# Altium schematic sheet Analog_Power.SchDoc
size 381 x 279 mm; Date: 9/28/2025; Organization: SACO Technologies; Address1: 7806, Trans-Canada Hwy; Address2: Montreal, QC, Canada - H4S1L3.; Address3: H4S1L3; ProjectRevision: C; SheetNumber: 4; SheetTotal: 7; SchDesignedBy1: Alexis Gagnon; SchDesignedBy2: Megane Cyr; ELE682ProjectName: Conditioning & TLL PCB
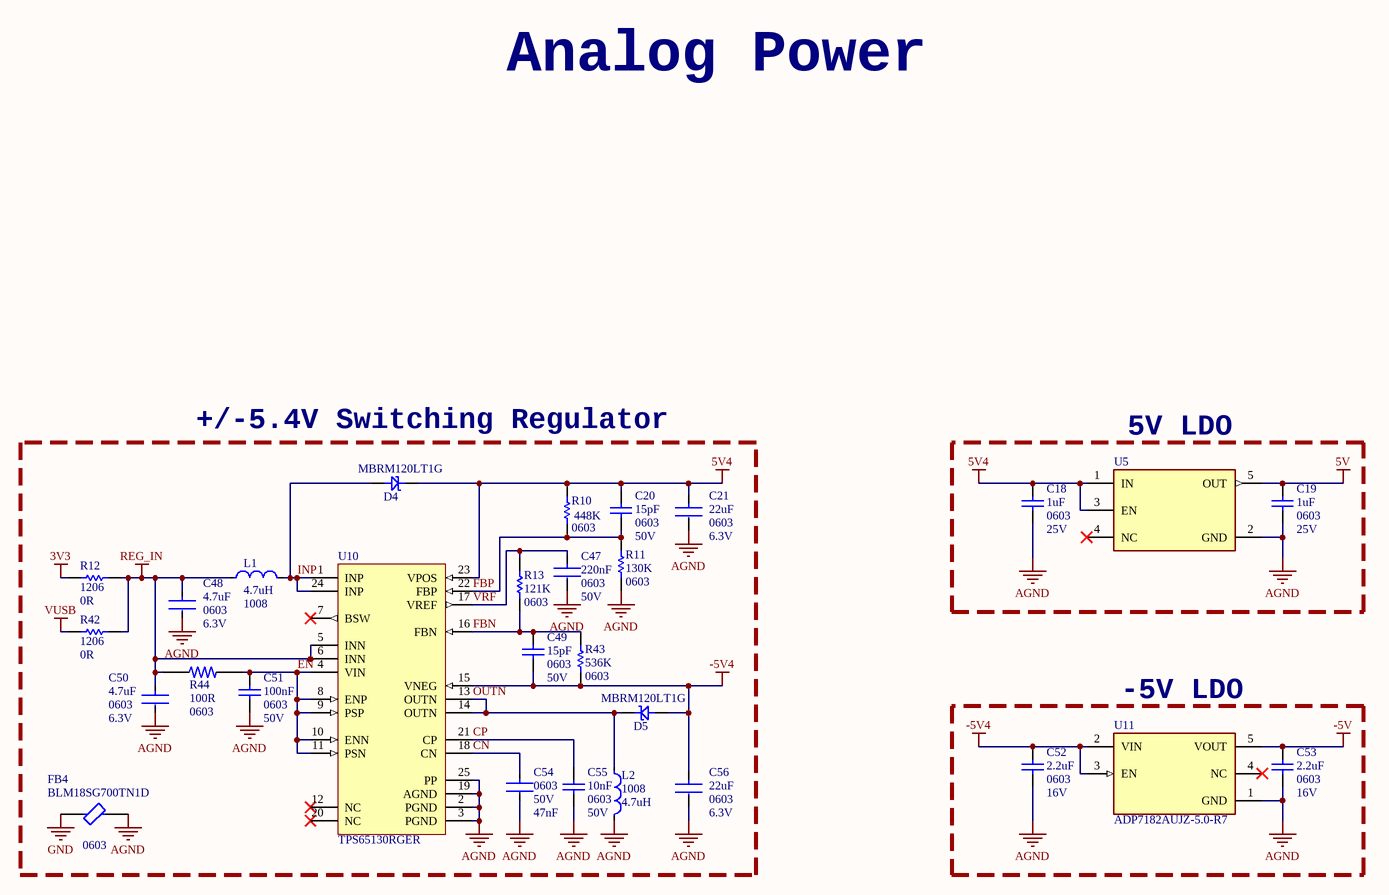
[diagram p0: Analog_Power.SchDoc]

## Parts
C18  value 1uF  Case/Package: 0603  Rated DC Voltage (URdc): 25V  [C0603-V2]  (hidden comment: CL10A105KA8NNNC)
C19  value 1uF  Case/Package: 0603  Rated DC Voltage (URdc): 25V  [C0603-V2]  (hidden comment: CL10A105KA8NNNC)
C20  value 15pF  Packaging: 0603  Voltage: 50V  [C0603-V2]  (hidden comment: CL10C150JB8NNNC)
C21  value 22uF  Rated DC Voltage (URdc): 6.3V  Case/Package: 0603  [C0603-V2]  (hidden comment: GRM188R60J226MEA0D)
C47  value 220nF  Voltage Rating: 50V  Case Code (Imperial): 0603  [C0603-V2]  (hidden comment: GRM188R71H224KAC4D)
C48  Package: 0603  Capacitance: 4.7uF  Voltage Rating: 6.3V  [FP-C0603-CG-IPC_B]  (hidden comment: C0603C475K9PACTU)
C49  value 15pF  Packaging: 0603  Voltage: 50V  [C0603-V2]  (hidden comment: CL10C150JB8NNNC)
C50  Package: 0603  Capacitance: 4.7uF  Voltage Rating: 6.3V  [FP-C0603-CG-IPC_B]  (hidden comment: C0603C475K9PACTU)
C51  value 100nF  Case/Package: 0603  Voltage Rating: 50V  [C0603-V2]  (hidden comment: CL10B104KB8NNWC)
C52  value 2.2uF  Case/Package: 0603  Rated DC Voltage (URdc): 16V  [C0603-V2]  (hidden comment: CL10A225KO8NNNC)
C53  value 2.2uF  Case/Package: 0603  Rated DC Voltage (URdc): 16V  [C0603-V2]  (hidden comment: CL10A225KO8NNNC)
C54  Case Code (Imperial): 0603  Voltage Rating: 50V  Capacitance: 47nF  [C0603]  (hidden comment: GCJ188R71H473KA12D)
C55  Voltage Rating: 50V  Case/Package: 0603  Capacitance: 10nF  [C0603-V2]  (hidden comment: GRM188R71H103KA01D)
C56  value 22uF  Rated DC Voltage (URdc): 6.3V  Case/Package: 0603  [C0603-V2]  (hidden comment: GRM188R60J226MEA0D)
D4  MBRM120LT1G  [ONSC-POWERMITE-2-457-04_D_V]
D5  MBRM120LT1G  [ONSC-POWERMITE-2-457-04_D_V]
FB4  BLM18SG700TN1D  Case Code (Imperial): 0603  [BLM18SG700TN1D-MFG]
L1  Case/Package: 1008  Inductance: 4.7uH  [FP-DFE252012C-MFG]  (hidden comment: 1239AS-H-4R7M=P2)
L2  Case/Package: 1008  Inductance: 4.7uH  [FP-DFE252012C-MFG]  (hidden comment: 1239AS-H-4R7M=P2)
R10  value 448K  Case/Package: 0603  [R0603]  (hidden comment: RT0603BRD07448KL)
R11  value 130K  Case/Package: 0603  [R0603]  (hidden comment: AC0603FR-07130KL)
R12  Case/Package: 1206  Resistance: 0R  [R1206]  (hidden comment: RC1206JR-070RL)
R13  value 121K  Case/Package: 0603  [R0603]  (hidden comment: RC0603FR-07121KL)
R42  Case/Package: 1206  Resistance: 0R  [R1206]  (hidden comment: RC1206JR-070RL)
R43  value 536K  Case/Package: 0603  [R0603]  (hidden comment: RC0603FR-07536KL)
R44  value 100R  Case/Package: 0603  [R0603]  (hidden comment: RC0603FR-07100RL)
U5  NCP161ASN500T1G  [FP-527AH-MFG]  (value not drawn)
U10  TPS65130RGER  [TI-RGE24-2450X2450TP_V]
U11  ADP7182AUJZ-5.0-R7  [FP-UJ-5-IPC_B]

## Blocks framed on the sheet
+/-5.4V Switching Regulator: C20 C21 C47-C51 C54-C56 D4 D5 FB4 L1 L2 R10-R13 R42-R44 U10
5V LDO: C18 C19 U5
-5V LDO: C52 C53 U11

## Nets
3V3: R12.1
5V: C19.2 U5.5(OUT)
5V4: C18.2 C20.2 C21.1 D4.1(K) R10.1 U5.1(IN) U5.3(EN) U10.23(VPOS)
-5V: C53.2 U11.5(VOUT)
-5V4: C49.1 C52.2 C56.1 D5.2(A) R43.2 U10.15(VNEG) U11.2(VIN) U11.3(EN)
AGND: C18.1 C19.1 C21.2 C47.2 C48.2 C50.2 C51.2 C52.1 C53.1 C54.1 C55.1 C56.2 FB4.2 L2.2 R11.2 U5.2(GND) U10.2(PGND) U10.3(PGND) U10.19(AGND) U10.25(PP) U11.1(GND)
GND: FB4.1
REG_IN: C48.1 C50.1 L1.1 R12.2 R42.2 R44.1 U10.5(INN) U10.6(INN)
VUSB: R42.1
CN: C54.2 U10.18(CN)
CP: C55.2 U10.21(CP)
EN: C51.1 R44.2 U10.4(VIN) U10.8(ENP) U10.9(PSP) U10.10(ENN) U10.11(PSN)
FBN: C49.2 R13.2 R43.1 U10.16(FBN)
FBP: C20.1 R10.2 R11.1 U10.22(FBP)
INP: D4.2(A) L1.2 U10.1(INP) U10.24(INP)
OUTN: D5.1(K) L2.1 U10.13(OUTN) U10.14(OUTN)
VRF: C47.1 R13.1 U10.17(VREF)

Not connected (* = marked no-connect by the designer): U5 4(NC)*; U10 7(BSW)* 12(NC)* 20(NC)*; U11 4(NC)*

## Notes on the sheet
- Analog Power
- Project:
- File:
- Date:
- Designed By :
- © COPYRIGHT 2024 École de Technologie Supérieure
- Revision:
- Sheet
- of
- 1100 Rue Notre-Dame Ouest, Montréal, QC H3C 1K3

## Library data of the parts
C18 C19 = CL10A105KA8NNNC: CAP CER 1UF 25V X5R 0603; Manufacturer: Samsung; Dielectric Material: Ceramic; Multilayer: Yes; Tolerance  (fill in as +-): 10%; Supplier: Arrow Electronics; Supplier Part Number: CL10A105KA8NNNC; Manufacturer Part Number: CL10A105KA8NNNC; RoHS: Yes; Category: Ceramic Capacitors; Stock: 444000; Pricing: 4000=0.0054, 8000=0.0044, 28000=0.0037, 100000=0.0034, 200000=0.0032 (USD); Mounting Technology: Surface Mount; Pins: 2; Package Shape: Rectangular; Terminal Finish: Nickel; Min Operating Temperature: -55°C; Max Operating Temperature: 85°C; JESD-609 Code: e3; Capacitor Type: Ceramic; Package Style: SMTMeter; Packaging: Tape and Reel; Tolerance (fill in as +-): 10%; Temperature Characteristics Code: X5R; Termination: Wraparound; Length: 1.6mm; Width: 0.8mm; Height: 0.9mm; Reach SVHC Compliant: Yes; RoHS Compliant: Yes; ComponentLink1URL: https://datasheet.ciiva.com:443/pdfs/VipMasterIC/IC/SEMS/SEMS-S-A0008520814/SEMS-S-A0008520762-1.pdf?src-supplier=IHS+Markit; ComponentLink1Description: https://datasheet.ciiva.com:443/pdfs/VipMasterIC/IC/SEMS/SEMS-S-A0008520814/SEMS-S-A0008520762-1.pdf?src-supplier=IHS+Markit; ComponentLink2URL: https://datasheet.ciiva.com/25801/cl10a105ka8nnnc-25801364.pdf?src-supplier=Digikey; ComponentLink2Description: https://datasheet.ciiva.com/25801/cl10a105ka8nnnc-25801364.pdf?src-supplier=Digikey; ComponentLink3URL: https://datasheet.ciiva.com/26838/getdatasheetpartid-357530-26838332.pdf?src-supplier=Verical; ComponentLink3Description: https://datasheet.ciiva.com/26838/getdatasheetpartid-357530-26838332.pdf?src-supplier=Verical; ComponentLink4URL: https://datasheet.ciiva.com/29198/458162-da-01-en-vs-kondensator-0603-29198475.pdf?src-supplier=Conrad; ComponentLink4Description: https://datasheet.ciiva.com/29198/458162-da-01-en-vs-kondensator-0603-29198475.pdf?src-supplier=Conrad
C20 C49 = CL10C150JB8NNNC: CAP CER 15PF 50V C0G/NP0 0603; Supplier 1: DigiKey; Supplier Part Number 1: 1276-1296-1-ND
C21 C56 = GRM188R60J226MEA0D: CAP CER 22UF 6.3V X5R 0603; Manufacturer: Murata; Dielectric Material: Ceramic; Multilayer: Yes; Tolerance  (fill in as +-): 20%; Supplier: Mouser; Supplier Part Number: 81-GRM188R60J226ME0D; Manufacturer Part Number: GRM188R60J226MEA0D; RoHS: Yes; Category: Ceramic Capacitors; Stock: 837789; Pricing: 1=0.1, 10=0.026, 50=0.026, 100=0.024, 1000=0.024, 10000=0.024 (USD); Mounting Technology: Surface Mount; Pins: 2; Package Shape: Rectangular; Terminal Finish: Nickel; Min Operating Temperature: -55°C; Max Operating Temperature: 85°C; JESD-609 Code: e3; Package Style: SMTMeter; Capacitor Type: Ceramic; Packaging: Tape and Reel; Tolerance (fill in as +-): 20%; Temperature Characteristics Code: X5R; Termination: Wraparound; Length: 1.6mm; Width: 0.8mm; Height: 0.8mm; Reach SVHC Compliant: Yes; RoHS Compliant: Yes; ComponentLink1URL: https://datasheet.ciiva.com:443/pdfs/VipMasterIC/IC/MURE/MURE-S-A0004349797/MURE-S-A0004352371-1.pdf?src-supplier=IHS+Markit; ComponentLink1Description: https://datasheet.ciiva.com:443/pdfs/VipMasterIC/IC/MURE/MURE-S-A0004349797/MURE-S-A0004352371-1.pdf?src-supplier=IHS+Markit; ComponentLink2URL: https://datasheet.ciiva.com/29540/partnumbering-e-01-29540441.pdf?src-supplier=Digikey; ComponentLink2Description: https://datasheet.ciiva.com/29540/partnumbering-e-01-29540441.pdf?src-supplier=Digikey; ComponentLink3URL: https://datasheet.ciiva.com/29540/partnumbering-e-01-29540442.pdf?src-supplier=Digikey; ComponentLink3Description: https://datasheet.ciiva.com/29540/partnumbering-e-01-29540442.pdf?src-supplier=Digikey; ComponentLink4URL: https://datasheet.ciiva.com/29540/partnumbering-e-01-29540443.pdf?src-supplier=Digikey; ComponentLink4Description: https://datasheet.ciiva.com/29540/partnumbering-e-01-29540443.pdf?src-supplier=Digikey
C47 = GRM188R71H224KAC4D: CAP CER 0.22UF 50V X7R 0603; Manufacturer: Murata; Manufacturer Lifecycle Status: IN PRODUCTION; Dielectric Material: Ceramic; Tolerance: 10%; Supplier: Avnet; Supplier Part Number: GRM188R71H224KAC4D; Manufacturer Part Number: GRM188R71H224KAC4D; RoHS: Compliant; Category: Ceramic Capacitors; Stock: 36000; Pricing: 4000=0.01597, 8000=0.0158, 16000=0.01571, 24000=0.01563, 32000=0.01555 (USD); Case/Package: 0603; Case Code (Metric): 1608; Dielectric: X7R; Height: 800µm; Lead Free: Lead Free; Length: 1.6mm; Lifecycle Status: Production; Material: Ceramic; Max Operating Temperature: 125°C; Min Operating Temperature: -55°C; Mounting Technology: Surface Mount; Number of Terminals: 2; REACH SVHC: Yes; Schedule B: 8532240020, 8532240020|8532240020, 8532240020|8532240020|8532240020, 8532240020|8532240020|8532240020|8532240020; Thickness: 800µm; Voltage Rating (DC): 50V; Width: 800µm; ComponentLink1URL: https://datasheet.octopart.com:443/GRM188R71H224KAC4D-Murata-datasheet-149523289.pdf?src-supplier=Newark; ComponentLink1Description: https://datasheet.octopart.com:443/GRM188R71H224KAC4D-Murata-datasheet-149523289.pdf?src-supplier=Newark; ComponentLink2URL: https://datasheet.octopart.com:443/GRM188R71H224KAC4D-Murata-datasheet-68590313.pdf?src-supplier=Newark; ComponentLink2Description: https://datasheet.octopart.com:443/GRM188R71H224KAC4D-Murata-datasheet-68590313.pdf?src-supplier=Newark; ComponentLink3URL: https://datasheet.octopart.com:443/GRM188R71H224KAC4D-Murata-datasheet-141275521.pdf?src-supplier=Geoflip; ComponentLink3Description: https://datasheet.octopart.com:443/GRM188R71H224KAC4D-Murata-datasheet-141275521.pdf?src-supplier=Geoflip; ComponentLink4URL: https://datasheet.octopart.com/GRM188R71H224KAC4D-Murata-datasheet-13366452.pdf; ComponentLink4Description: https://datasheet.octopart.com/GRM188R71H224KAC4D-Murata-datasheet-13366452.pdf; ComponentLink5URL: https://datasheet.octopart.com/GRM188R71H224KAC4D-Murata-datasheet-12515295.pdf; ComponentLink5Description: https://datasheet.octopart.com/GRM188R71H224KAC4D-Murata-datasheet-12515295.pdf; ComponentLink6URL: https://datasheet.octopart.com/GRM188R71H224KAC4D-Murata-datasheet-12510076.pdf; ComponentLink6Description: https://datasheet.octopart.com/GRM188R71H224KAC4D-Murata-datasheet-12510076.pdf; ComponentLink7URL: https://datasheet.octopart.com/GRM188R71H224KAC4D-Murata-datasheet-11978611.pdf; ComponentLink7Description: https://datasheet.octopart.com/GRM188R71H224KAC4D-Murata-datasheet-11978611.pdf; ComponentLink8URL: https://datasheet.octopart.com/GRM188R71H224KAC4D-Murata-datasheet-10025737.pdf; ComponentLink8Description: https://datasheet.octopart.com/GRM188R71H224KAC4D-Murata-datasheet-10025737.pdf; ComponentLink9URL: https://datasheet.octopart.com/GRM188R71H224KAC4D-Murata-datasheet-8819587.pdf; ComponentLink9Description: https://datasheet.octopart.com/GRM188R71H224KAC4D-Murata-datasheet-8819587.pdf; ComponentLink10URL: https://datasheet.octopart.com:443/GRM188R71H224KAC4D-Murata-datasheet-165579666.pdf?src-supplier=TME; ComponentLink10Description: https://datasheet.octopart.com:443/GRM188R71H224KAC4D-Murata-datasheet-165579666.pdf?src-supplier=TME; ComponentLink11URL: https://datasheet.octopart.com:443/GRM188R71H224KAC4D-Murata-datasheet-140705679.pdf?src-supplier=Ciiva; ComponentLink11Description: https://datasheet.octopart.com:443/GRM188R71H224KAC4D-Murata-datasheet-140705679.pdf?src-supplier=Ciiva; ComponentLink12URL: https://datasheet.octopart.com:443/GRM188R71H224KAC4D-Murata-datasheet-138743219.pdf?src-supplier=Ciiva; ComponentLink12Description: https://datasheet.octopart.com:443/GRM188R71H224KAC4D-Murata-datasheet-138743219.pdf?src-supplier=Ciiva; ComponentLink13URL: https://datasheet.octopart.com:443/GRM188R71H224KAC4D-Murata-datasheet-14397325.pdf?src-supplier=Future+Electronics; ComponentLink13Description: https://datasheet.octopart.com:443/GRM188R71H224KAC4D-Murata-datasheet-14397325.pdf?src-supplier=Future+Electronics; ComponentLink14URL: https://datasheet.octopart.com:443/GRM188R71H224KAC4D-Murata-datasheet-150009171.pdf?src-supplier=Arrow.cn; ComponentLink14Description: https://datasheet.octopart.com:443/GRM188R71H224KAC4D-Murata-datasheet-150009171.pdf?src-supplier=Arrow.cn; ComponentLink15URL: http://sigma.octopart.com:80/reach_statement/Murata-company-16.pdf?src-supplier=Compliance+Statements; ComponentLink15Description: http://sigma.octopart.com:80/reach_statement/Murata-company-16.pdf?src-supplier=Compliance+Statements
C48 C50 = CMP-2006-02256-2: CAP CER 4.7UF 6.3V X5R 0603; Manufacturer: Kemet; Temperature Coefficient: 15%; Tolerance: 10%; Material: Ceramic; Device Class L3: Ceramic Capacitors; RoHS: TRUE; Value: 4.7uF; Lead Free: Yes; ComponentLink2Description: Datasheet; Mouser Description: Multilayer Ceramic Capacitors MLCC - SMD/SMT 6.3volts 4.7uF X5R 10%; Digikey Description: CAP CER 4.7UF 6.3V X5R 0603; ComponentLink2URL: https://content.kemet.com/datasheets/KEM_C1006_X5R_SMD.pdf; Category: Cap; Temperature Range Low: -55°C; Temperature: -55°C to +85°C; Octopart: https://octopart.com/c0603c475k9pactu-kemet-104242; Ipc Land Pattern Name: CAPC16080X80; Temperature Range High: +85°C; Height: 0.9mm; Temperature Characteristic: X5R; Device Class L1: Passive Components; Manufacturer Part Number: C0603C475K9PACTU; Automotive: No; Device Class L2: Capacitors
C51 = CL10B104KB8NNWC: CAP CER 0.1UF 50V X7R 0603; Manufacturer: Samsung; Tolerance: 10%; Supplier: Arrow Electronics; Supplier Part Number: CL10B104KB8NNWC; Manufacturer Part Number: CL10B104KB8NNWC; RoHS: Yes; Category: Ceramic Capacitors; Stock: 4312000; Pricing: 4000=0.0024 (USD); Mounting Technology: Surface Mount; Case Code (Metric): 1608; Case Code (Imperial): 0603; Min Operating Temperature: -55°C; Max Operating Temperature: 125°C; Package Quantity: 1; Packaging: Cut Tape; Series: CL; Length: 0.063inch; Width: 0.031inch; Thickness: 0.035inch; RoHS Compliant: Yes; ComponentLink1URL: https://datasheet.ciiva.com/25740/cl10b104kb8nnwc-25740227.pdf?src-supplier=Digikey; ComponentLink1Description: https://datasheet.ciiva.com/25740/cl10b104kb8nnwc-25740227.pdf?src-supplier=Digikey
C52 C53 = CL10A225KO8NNNC: CAP CER 2.2UF 16V X5R 0603; Manufacturer: Samsung; Dielectric Material: Ceramic; Multilayer: Yes; Tolerance  (fill in as +-): 10%; Supplier: Arrow Electronics; Supplier Part Number: CL10A225KO8NNNC; Manufacturer Part Number: CL10A225KO8NNNC; RoHS: Yes; Category: Ceramic Capacitors; Stock: 1492000; Pricing: 4000=0.0119, 8000=0.0101, 12000=0.0092, 28000=0.0082, 100000=0.0069, 200000=0.0066 (USD); Mounting Technology: Surface Mount; Pins: 2; Package Shape: Rectangular; Terminal Finish: Nickel; Min Operating Temperature: -55°C; Max Operating Temperature: 85°C; JESD-609 Code: e3; Capacitor Type: Ceramic; Package Style: SMTMeter; Packaging: Tape and Reel; Tolerance (fill in as +-): 10%; Temperature Characteristics Code: X5R; Termination: Wraparound; Length: 1.6mm; Width: 0.8mm; Height: 0.9mm; Reach SVHC Compliant: Yes; RoHS Compliant: Yes; ComponentLink1URL: https://datasheet.ciiva.com:443/pdfs/VipMasterIC/IC/SEMS/SEMS-S-A0008524842/SEMS-S-A0008524788-1.pdf?src-supplier=IHS+Markit; ComponentLink1Description: https://datasheet.ciiva.com:443/pdfs/VipMasterIC/IC/SEMS/SEMS-S-A0008524842/SEMS-S-A0008524788-1.pdf?src-supplier=IHS+Markit; ComponentLink2URL: http://www.farnell.com/datasheets/2735906.pdf?src-supplier=Newark; ComponentLink2Description: http://www.farnell.com/datasheets/2735906.pdf?src-supplier=Newark
C54 = CMP-2006-02231-3: Cap Ceramic 47000pF 50V X7R 10% Pad SMD 0603 Soft Termination +125°C Automotive T/R; Ratings: AEC-Q200; Packaging: Tape and Reel; Termination: SMD/SMT; Features: Soft Termination; Min Operating Temperature: -55°C; Package Quantity: 1; Width: 0.031inch; Case Code (Metric): 1608; Max Operating Temperature: 125°C; Voltage Rating (DC): 50V; Tolerance: 10%; Thickness: 0.031inch; Length: 0.063inch; Dielectric: X7R; Mount: Surface Mount; Case/Package: 0603
C55 = CMP-2100-03642-1: Chip Capacitor, 10 nF, +/- 10%, 50 V, -55 to 125 degC, 0603 (1608 Metric), RoHS, Tape and Reel; Manufacturer: Murata; Insulation Resistance: 10GR; Dielectric: X7R; Material: Ceramic; Package Quantity: 1; Lead Free: LeadFree; Termination: SMD/SMT; REACH SVHC: Unknown; Manufacturer URL: http://www.murata.com/; Datasheet URL: http://search.murata.co.jp/Ceramy/image/img/A01X/G101/ENG/GRM188R71H103KA01-01.pdf; Mount: SurfaceMount; Datasheet Version: 42401.0; Number of Pins: 2; Length: 1.6mm; Voltage: 50V; Depth: 0.8mm; Tolerance: 10%; Min Operating Temperature: -55degC; Voltage Rating (DC): 50V; Max Operating Temperature: 125degC; Package Description: 2-Pin Surface Mount Device, Body 1.6 x 0.8 mm; RoHSCompliant: True; Case Code (Imperial): 0603; Width: 0.031inch; Case Code (Metric): 1608; Height: 0.8mm; Package Reference: 0603; Packaging: TapeandReel; Thickness: 0.035inch; Dielectric Material: Ceramic
D4 D5 = MBRM120LT1G: DIODE SCHOTTKY 20V 1A POWERMITE; Manufacturer: On Semiconductor; IFSM Max (A): 50; Configuration: Single; Packing: Tape and Reel; ComponentLink1Description: Manufacturer URL; ComponentLink3URL: http://www.onsemi.com/pub_link/Collateral/457-04.PDF; PackageDescription: 2-Pin POWERMITE, Body 1.965 x 1.9 mm; DatasheetVersion: Rev. 7; Mounting Technology: Surface Mount; ComponentLink1URL: http://www.onsemi.com/; PackageVersion: Rev. F, 05/2013; ComponentLink2Description: Datasheet; PackageReference: POWERMITE-2-457-04; RoHS: TRUE; PartNumber: MBRM120LT1G; ComponentLink2URL: http://www.onsemi.cn/pub_link/Collateral/MBRM120L-D.PDF; ComponentLink3Description: Package Specification
FB4 = BLM18SG700TN1D: FERRITE BEAD 70 OHM 0603 1LN; Manufacturer: Murata; Max DC Current: 4A; Tolerance: 25%; DC Resistance (DCR): 20mR; Material: Steel; Test Frequency: 100MHz; Number of Circuits: 1; Impedance: 70R; Filter Type: FERRITE CHIP; Lead Free: Lead Free; Min Operating Temperature: -55°C; Width: 0.8mm; Case Code (Metric): 1608; RoHS Compliant: Yes; Core Material: Ferrite; Max Operating Temperature: 125°C; Number of Pins: 2; Current Rating: 4A; Series: BLM18S; Depth: 0.8mm; Packaging: Tape and Reel; Height: 0.8mm; Number of Lines: 1; Case/Package: 0603; Package Quantity: 1; Termination: SMD/SMT; REACH SVHC: No SVHC; Max Current Rating: 4A; DC Resistance-Max: 20mR; Length: 1.6mm; Supplier: Mouser; Supplier Part Number: 81-BLM18SG700TN1D; Manufacturer Part Number: BLM18SG700TN1D; RoHS: Yes; Category: Ferrite Beads and Chips; Stock: 139676; Pricing: 1=0.14, 10=0.071, 50=0.071, 100=0.049, 1000=0.041, 10000=0.03 (USD); Mounting Technology: Surface Mount; Case Code: 0603; Terminal Finish: Tin; JESD-609 Code: e3; Construction: Chip Bead; Clock Frequency: 100MHz; Min Frequency: 100MHz; Channels: 1; Output Impedance: 70R; Reach SVHC Compliant: Yes; ComponentLink1URL: https://datasheet.ciiva.com:443/pdfs/VipMasterIC/IC/MURE/MURE-S-A0008515766/MURE-S-A0008515869-1.pdf?src-supplier=IHS+Markit; ComponentLink1Description: https://datasheet.ciiva.com:443/pdfs/VipMasterIC/IC/MURE/MURE-S-A0008515766/MURE-S-A0008515869-1.pdf?src-supplier=IHS+Markit; ComponentLink2URL: https://datasheet.ciiva.com/8021/5151-8021529.pdf?src-supplier=Element14; ComponentLink2Description: https://datasheet.ciiva.com/8021/5151-8021529.pdf?src-supplier=Element14; ComponentLink3URL: https://datasheet.ciiva.com/8021/5151-8021530.pdf?src-supplier=Element14; ComponentLink3Description: https://datasheet.ciiva.com/8021/5151-8021530.pdf?src-supplier=Element14; ComponentLink4URL: https://datasheet.ciiva.com/14122/blm-series-eng-tds-14122901.pdf?src-supplier=Distrelec; ComponentLink4Description: https://datasheet.ciiva.com/14122/blm-series-eng-tds-14122901.pdf?src-supplier=Distrelec; ComponentLink5URL: https://datasheet.ciiva.com/6212/l0110s0100blm18s-6212357.pdf?src-supplier=Digikey; ComponentLink5Description: https://datasheet.ciiva.com/6212/l0110s0100blm18s-6212357.pdf?src-supplier=Digikey; ComponentLink6URL: https://datasheet.ciiva.com/6212/l0110s0100blm18s-6212359.pdf?src-supplier=Digikey; ComponentLink6Description: https://datasheet.ciiva.com/6212/l0110s0100blm18s-6212359.pdf?src-supplier=Digikey; ComponentLink7URL: https://datasheet.ciiva.com/16420/l0110s0100blm18s-16420729.pdf?src-supplier=Future+Electronics; ComponentLink7Description: https://datasheet.ciiva.com/16420/l0110s0100blm18s-16420729.pdf?src-supplier=Future+Electronics
L1 L2 = 1239AS-H-4R7M=P2: Shielded Wirewound Inductor 4.7uH 20% 1300mA 0.24Ω 1008 (2520); Current Rating: 1.5A; Core Material: Ferrite; DC Resistance (DCR): 240mR; Test Frequency: 1MHz; Resistor Type: Wirewound; Mount: Surface Mount; Case Code (Metric): 2520; Width: 0.079inch; Min Operating Temperature: -40°C; Height - Seated (Max): 0.047inch; Length: 0.098inch; Max Operating Temperature: 85°C; Tolerance: 20%; Case Code (Imperial): 1008; Shielding: Shielded; Packaging: Tape and Reel
R10 = RT0603BRD07448KL: RES 448K OHM 0.1% 1/10W 0603; ComponentLink1URL: https://datasheet.ciiva.com:443/pdfs/VipMasterIC/IC/YAGO/YAGO-S-A0008145938/YAGO-S-A0008145938-1.pdf?src-supplier=IHS+Markit; ComponentLink1Description: https://datasheet.ciiva.com:443/pdfs/VipMasterIC/IC/YAGO/YAGO-S-A0008145938/YAGO-S-A0008145938-1.pdf?src-supplier=IHS+Markit; Supplier 1: DigiKey; Supplier Part Number 1: 13-RT0603BRD07448KLCT-ND
R11 = AC0603FR-07130KL: RES SMD 130K OHM 1% 1/10W 0603; ComponentLink1URL: https://datasheet.ciiva.com:443/pdfs/VipMasterIC/IC/YAGO/YAGO-S-A0008145938/YAGO-S-A0008145938-1.pdf?src-supplier=IHS+Markit; ComponentLink1Description: https://datasheet.ciiva.com:443/pdfs/VipMasterIC/IC/YAGO/YAGO-S-A0008145938/YAGO-S-A0008145938-1.pdf?src-supplier=IHS+Markit; Supplier 1: Avnet; Supplier Part Number 1: 58AK8937
R12 R42 = RC1206JR-070RL: RES 0 OHM JUMPER 1/4W 1206; Manufacturer: YAGEO; Voltage Rating: 200V; Temperature Coefficient: 300ppm/°C; Power Rating: 0.25W; Value: 0Ω; Tolerance: 5%; Power: 250mW; Rated Temperature: 70°C; Package Height: 0.55mm; Package Length: 3.1mm; Package Width: 1.6mm; Manufacturer Part Number: RC1206JR-070RL; Temperature Range Low: -55°C; Category: Res; Automotive: No; Ipc Land Pattern Name: RESC310160X55; Device Class L1: Passive Components; Temperature: -55°C to +155°C; ComponentLink2URL: https://www.yageo.com/upload/media/product/productsearch/datasheet/rchip/PYu-RC_Group_51_RoHS_L_10.pdf; Lead Free: Yes; Height: 0.65mm; Footprint Url: https://www.yageo.com/upload/website/yageo_PYu-R_Mount_10_19050818_343.pdf; Package: RC1206; Digikey Description: RES SMD 0 OHM JUMPER 1/4W 1206; Temperature Range High: +155°C; Device Class L3: Chip SMD Resistors; Device Class L2: Resistors; Octopart: https://octopart.com/rc1206jr-070rl-yageo-40025601; Series: RC; ComponentLink2Description: Datasheet; Composition: Thick Film; RoHS: TRUE; Mouser Description: Resistor: thick film; SMD; 1206; 0O; 0.25W; ±5%; -55÷155°C; Supplier: Future Electronics; Supplier Part Number: 1414689; Stock: 40265000; Pricing: 5000=0.0038, 15000=0.0036, 25000=0.0036, 75000=0.0034, 125000=0.0033 (USD); Mounting Technology: Surface Mount; Pins: 2; Package Shape: Rectangular; Terminal Finish: Nickel; Min Operating Temperature: -55°C; Max Operating Temperature: 155°C; JESD-609 Code: e3; Resistor Type: FIXED RESISTOR; Construction: Chip; Packaging: Tape and Reel; Technology: METAL GLAZE/THICK FILM; Termination: Wraparound; Reach SVHC Compliant: Yes; RoHS Compliant: Yes; ComponentLink1URL: https://datasheet.ciiva.com:443/pdfs/VipMasterIC/IC/YAGO/YAGO-S-A0008145938/YAGO-S-A0008145938-1.pdf?src-supplier=IHS+Markit; ComponentLink1Description: https://datasheet.ciiva.com:443/pdfs/VipMasterIC/IC/YAGO/YAGO-S-A0008145938/YAGO-S-A0008145938-1.pdf?src-supplier=IHS+Markit; ComponentLink3URL: https://datasheet.ciiva.com/11808/0900766b80c6630a-11808156.pdf?src-supplier=Rs; ComponentLink3Description: https://datasheet.ciiva.com/11808/0900766b80c6630a-11808156.pdf?src-supplier=Rs; ComponentLink4URL: https://datasheet.ciiva.com/7857/1692832-7857421.pdf?src-supplier=Element14; ComponentLink4Description: https://datasheet.ciiva.com/7857/1692832-7857421.pdf?src-supplier=Element14; ComponentLink5URL: https://datasheet.ciiva.com/7857/1692832-7857422.pdf?src-supplier=Element14; ComponentLink5Description: https://datasheet.ciiva.com/7857/1692832-7857422.pdf?src-supplier=Element14; ComponentLink6URL: https://datasheet.ciiva.com/46445/444357-46445719.pdf?src-supplier=Element14; ComponentLink6Description: https://datasheet.ciiva.com/46445/444357-46445719.pdf?src-supplier=Element14; ComponentLink7URL: https://datasheet.ciiva.com/22747/1692832-22747541.pdf?src-supplier=Element14; ComponentLink7Description: https://datasheet.ciiva.com/22747/1692832-22747541.pdf?src-supplier=Element14; ComponentLink8URL: https://datasheet.ciiva.com/2458/pyu-rc1206-51-rohs-l-4-2458668.pdf?src-supplier=Digikey; ComponentLink8Description: https://datasheet.ciiva.com/2458/pyu-rc1206-51-rohs-l-4-2458668.pdf?src-supplier=Digikey; ComponentLink9URL: https://datasheet.ciiva.com/2458/pyu-rc1206-51-rohs-l-4-2458669.pdf?src-supplier=Digikey; ComponentLink9Description: https://datasheet.ciiva.com/2458/pyu-rc1206-51-rohs-l-4-2458669.pdf?src-supplier=Digikey; ComponentLink10URL: https://datasheet.ciiva.com/2458/pyu-rc1206-51-rohs-l-4-2458670.pdf?src-supplier=Digikey; ComponentLink10Description: https://datasheet.ciiva.com/2458/pyu-rc1206-51-rohs-l-4-2458670.pdf?src-supplier=Digikey; ComponentLink11URL: https://datasheet.ciiva.com/17035/pyu-rc1206-51-rohs-l-4-17035512.pdf?src-supplier=Future+Electronics; ComponentLink11Description: https://datasheet.ciiva.com/17035/pyu-rc1206-51-rohs-l-4-17035512.pdf?src-supplier=Future+Electronics
R13 = RC0603FR-07121KL: RES 121K OHM 1% 1/10W 0603; ComponentLink1URL: https://datasheet.ciiva.com:443/pdfs/VipMasterIC/IC/YAGO/YAGO-S-A0008145938/YAGO-S-A0008145938-1.pdf?src-supplier=IHS+Markit; ComponentLink1Description: https://datasheet.ciiva.com:443/pdfs/VipMasterIC/IC/YAGO/YAGO-S-A0008145938/YAGO-S-A0008145938-1.pdf?src-supplier=IHS+Markit; Supplier 1: Avnet; Supplier Part Number 1: RC0603FR-07121KL
R43 = RC0603FR-07536KL: RES 536K OHM 1% 1/10W 0603; ComponentLink1URL: https://datasheet.ciiva.com:443/pdfs/VipMasterIC/IC/YAGO/YAGO-S-A0008145938/YAGO-S-A0008145938-1.pdf?src-supplier=IHS+Markit; ComponentLink1Description: https://datasheet.ciiva.com:443/pdfs/VipMasterIC/IC/YAGO/YAGO-S-A0008145938/YAGO-S-A0008145938-1.pdf?src-supplier=IHS+Markit; Supplier 1: Avnet; Supplier Part Number 1: 49AK2679
R44 = RC0603FR-07100RL: RES 100 OHM 1% 1/10W 0603; Manufacturer: Yageo Group; Power Dissipation: 100mW; Temperature Coefficient: 100ppm/°C; Voltage Rating: 75V; Voltage Rating (DC): 50V; Package: None; MP: RC0603FR-07100RL; Availability: Unavailable; Price: None; Supplier: Avnet; Supplier Part Number: RC0603FR-07100RL; Manufacturer Part Number: RC0603FR-07100RL; RoHS: Compliant; Category: Chip SMD Resistors; Stock: 2400000; Pricing: 5000=0.00136, 10000=0.00132, 20000=0.00129, 30000=0.00126, 40000=0.00123 (USD); Case Code (Imperial): 0603; Case Code (Metric): 0603; China RoHS: Non-Compliant; Composition: Thick Film; Depth: 800µm; Height: 450µm; Lead Free: Lead Free; Length: 1.6mm; Lifecycle Status: Production; Max Operating Temperature: 155°C; Military Standard: Not; Min Operating Temperature: -55°C; Mounting Technology: Surface Mount; Pins: 2; Number of Terminals: 2; Packaging: Cut Tape (CT); Power Rating: 100mW; REACH SVHC: Yes; Schedule B: 8533210045, 8533210045|8533210045|8533210045|8533210045|8533210045|8533210045|8533210045|8533210045|8533210045|8533210045|8533210045|8533210045|8533210045|8533210045|8533210045|8533210045|8533210045|8533210045|8533210045|8533210045|8533210045|8533210045|8533210045|85; Termination: SMD/SMT; Tolerance: 1%; Width: 800µm; Working Voltage: 75V; ComponentLink1URL: https://datasheet.octopart.com:443/RC0603FR-07100RL-Yageo-datasheet-175887523.pdf?src-supplier=IHS; ComponentLink1Description: https://datasheet.octopart.com:443/RC0603FR-07100RL-Yageo-datasheet-175887523.pdf?src-supplier=IHS; ComponentLink2URL: https://datasheet.octopart.com:443/RC0603FR-07100RL-Yageo-datasheet-8328172.pdf?src-supplier=Newark; ComponentLink2Description: https://datasheet.octopart.com:443/RC0603FR-07100RL-Yageo-datasheet-8328172.pdf?src-supplier=Newark; ComponentLink3URL: https://datasheet.octopart.com:443/RC0603FR-07100RL-Yageo-datasheet-34211833.pdf?src-supplier=Newark; ComponentLink3Description: https://datasheet.octopart.com:443/RC0603FR-07100RL-Yageo-datasheet-34211833.pdf?src-supplier=Newark; ComponentLink4URL: https://datasheet.octopart.com:443/RC0603FR-07100RL-Yageo-datasheet-103092701.pdf?src-supplier=Upverter; ComponentLink4Description: https://datasheet.octopart.com:443/RC0603FR-07100RL-Yageo-datasheet-103092701.pdf?src-supplier=Upverter; ComponentLink5URL: https://datasheet.octopart.com:443/RC0603FR-07100RL-Yageo-datasheet-62067350.pdf?src-supplier=element14+APAC; ComponentLink5Description: https://datasheet.octopart.com:443/RC0603FR-07100RL-Yageo-datasheet-62067350.pdf?src-supplier=element14+APAC; ComponentLink6URL: https://datasheet.octopart.com:443/RC0603FR-07100RL-Yageo-datasheet-17842380.pdf?src-supplier=element14+APAC; ComponentLink6Description: https://datasheet.octopart.com:443/RC0603FR-07100RL-Yageo-datasheet-17842380.pdf?src-supplier=element14+APAC; ComponentLink7URL: https://datasheet.octopart.com:443/RC0603FR-07100RL-Yageo-datasheet-12596169.pdf?src-supplier=Future+Electronics; ComponentLink7Description: https://datasheet.octopart.com:443/RC0603FR-07100RL-Yageo-datasheet-12596169.pdf?src-supplier=Future+Electronics; ComponentLink8URL: https://datasheet.octopart.com:443/RC0603FR-07100RL-Yageo-datasheet-164759695.pdf?src-supplier=Future+Electronics; ComponentLink8Description: https://datasheet.octopart.com:443/RC0603FR-07100RL-Yageo-datasheet-164759695.pdf?src-supplier=Future+Electronics; ComponentLink9URL: https://datasheet.octopart.com:443/RC0603FR-07100RL-Yageo-datasheet-137700087.pdf?src-supplier=Future+Electronics; ComponentLink9Description: https://datasheet.octopart.com:443/RC0603FR-07100RL-Yageo-datasheet-137700087.pdf?src-supplier=Future+Electronics; ComponentLink10URL: https://datasheet.octopart.com:443/RC0603FR07100RL-Yageo-datasheet-27584510.pdf?src-supplier=Future+Electronics; ComponentLink10Description: https://datasheet.octopart.com:443/RC0603FR07100RL-Yageo-datasheet-27584510.pdf?src-supplier=Future+Electronics; ComponentLink11URL: https://datasheet.octopart.com:443/RC0603FR-07100RL-Yageo-datasheet-15599030.pdf?src-supplier=Future+Electronics; ComponentLink11Description: https://datasheet.octopart.com:443/RC0603FR-07100RL-Yageo-datasheet-15599030.pdf?src-supplier=Future+Electronics; ComponentLink12URL: https://datasheet.octopart.com:443/RC0603FR-07100RL-Yageo-datasheet-8324193.pdf?src-supplier=Future+Electronics; ComponentLink12Description: https://datasheet.octopart.com:443/RC0603FR-07100RL-Yageo-datasheet-8324193.pdf?src-supplier=Future+Electronics; ComponentLink13URL: https://datasheet.octopart.com:443/RC0603FR-07100RL-Yageo-datasheet-79472498.pdf?src-supplier=Megastar; ComponentLink13Description: https://datasheet.octopart.com:443/RC0603FR-07100RL-Yageo-datasheet-79472498.pdf?src-supplier=Megastar; ComponentLink14URL: https://datasheet.octopart.com/RC0603FR-07100RL-Yageo-datasheet-73766026.pdf; ComponentLink14Description: https://datasheet.octopart.com/RC0603FR-07100RL-Yageo-datasheet-73766026.pdf; ComponentLink15URL: https://datasheet.octopart.com:443/RC0603FR-07100RL-Yageo-datasheet-13691069.pdf?src-supplier=Farnell; ComponentLink15Description: https://datasheet.octopart.com:443/RC0603FR-07100RL-Yageo-datasheet-13691069.pdf?src-supplier=Farnell; ComponentLink16URL: https://datasheet.octopart.com:443/RC0603FR-07100RL-Yageo-datasheet-118562.pdf?src-supplier=DigiKey; ComponentLink16Description: https://datasheet.octopart.com:443/RC0603FR-07100RL-Yageo-datasheet-118562.pdf?src-supplier=DigiKey; ComponentLink17URL: http://sigma.octopart.com:80/rohs_statement/Yageo-company-2.pdf?src-supplier=Compliance+Statements; ComponentLink17Description: http://sigma.octopart.com:80/rohs_statement/Yageo-company-2.pdf?src-supplier=Compliance+Statements; ComponentLink18URL: http://sigma.octopart.com:80/conflict_mineral_statement/Yageo-company-3.pdf?src-supplier=Compliance+Statements; ComponentLink18Description: http://sigma.octopart.com:80/conflict_mineral_statement/Yageo-company-3.pdf?src-supplier=Compliance+Statements
U5 = NCP161ASN500T1G: IC REG LINEAR 5V 450MA SOT23-5; Manufacturer: onsemi; Manufacturer Lifecycle Status: ACTIVE; Accuracy: 2%; Max Supply Voltage: 5.5V; Max Junction Temperature (Tj): 125°C; Nominal Supply Current: 18µA; Number of Channels: 1; Supplier: DigiKey; Supplier Part Number: 488-NCP161ASN500T1GCT-ND; Manufacturer Part Number: NCP161ASN500T1G; RoHS: Compliant; Category: LDO Voltage Regulators; Stock: 3716; Pricing: 1=0.55, 10=0.384, 25=0.3436, 100=0.299, 250=0.27776, 500=0.26496, 1000=0.25443 (USD); China RoHS: Compliant; Height: 1.45mm; Height - Seated (Max): 1.45mm; Length: 2.9mm; Lifecycle Status: Production; Max Operating Temperature: 125°C; Min Input Voltage: 5.5V; Min Operating Temperature: -40°C; Number of Circuits: 1; Number of Outputs: 1; Number of Terminals: 5; Output Current: 450mA; Output Voltage: 5V; REACH SVHC: Yes; Terminal Pitch: 950µm; Voltage Tolerance: 2%; Width: 1.6mm; ComponentLink1URL: https://datasheet.octopart.com:443/NCP161ASN500T1G-onsemi-datasheet-168844908.pdf?src-supplier=Upverter; ComponentLink1Description: https://datasheet.octopart.com:443/NCP161ASN500T1G-onsemi-datasheet-168844908.pdf?src-supplier=Upverter; ComponentLink2URL: https://sigma.octopart.com:443/165835405/technical_drawing/onsemi-NCP161ASN500T1G.pdf?src-supplier=Upverter; ComponentLink2Description: https://sigma.octopart.com:443/165835405/technical_drawing/onsemi-NCP161ASN500T1G.pdf?src-supplier=Upverter; ComponentLink3URL: https://datasheet.octopart.com:443/NCP161ASN500T1G-onsemi-datasheet-180965172.pdf?src-supplier=IHS; ComponentLink3Description: https://datasheet.octopart.com:443/NCP161ASN500T1G-onsemi-datasheet-180965172.pdf?src-supplier=IHS; ComponentLink4URL: https://datasheet.octopart.com:443/NCP161ASN500T1G-ON-Semiconductor-datasheet-99719185.pdf?src-supplier=Master+Electronics; ComponentLink4Description: https://datasheet.octopart.com:443/NCP161ASN500T1G-ON-Semiconductor-datasheet-99719185.pdf?src-supplier=Master+Electronics; ComponentLink5URL: https://datasheet.octopart.com:443/NCP161ASN500T1G-ON-Semiconductor-datasheet-34141821.pdf?src-supplier=onsemi; ComponentLink5Description: https://datasheet.octopart.com:443/NCP161ASN500T1G-ON-Semiconductor-datasheet-34141821.pdf?src-supplier=onsemi; ComponentLink6URL: https://datasheet.octopart.com:443/NCP161ASN500T1G-onsemi-datasheet-155341620.pdf?src-supplier=Future+Electronics; ComponentLink6Description: https://datasheet.octopart.com:443/NCP161ASN500T1G-onsemi-datasheet-155341620.pdf?src-supplier=Future+Electronics; ComponentLink7URL: http://sigma.octopart.com:80/150622221/rohs_statement/ON-Semiconductor-NCP161ASN500T1G.pdf?src-supplier=Compliance+Statements; ComponentLink7Description: http://sigma.octopart.com:80/150622221/rohs_statement/ON-Semiconductor-NCP161ASN500T1G.pdf?src-supplier=Compliance+Statements; ComponentLink8URL: http://sigma.octopart.com:80/reach_statement/ON-Semiconductor-company-79.pdf?src-supplier=Compliance+Statements; ComponentLink8Description: http://sigma.octopart.com:80/reach_statement/ON-Semiconductor-company-79.pdf?src-supplier=Compliance+Statements; ComponentLink9URL: https://octopart.com:443/opatz8j6/c1?t=cbbMWfdUDij4MfgLX7a0icoHAsoEWyjZ7ItffUOU59xa6cWZ6gdgYVMjRiUFRubHptHyxIgecg8St4SNvS5kC7qYsn393jq5q5E1H77MWXpCSd0z9wIk4Lfyy6q-pK24EHs3wl7DxTjSJXXLbzYRqIODitzW1SA1PdjY9_8jkXuN9qrMClwo-2MoM21vcuLI8vnhAKaQM4ie8XZ3WvbFTjifiAoocGAKEQewuyxoh4BjYvxUcORHKOI0vu4b8SY6R0A32Q-YBZSOt6wJ3xNB3a0e0ltVjeyJ75R2UolRcOCno4i0iTV2rlpTKYl7qtKP5BF-F0Lr19jDfElN9mJFHodSGoyxN8Fve5qI3feLx1Jx4g&src-supplier=Compliance+Statements; ComponentLink9Description: https://octopart.com:443/opatz8j6/c1?t=cbbMWfdUDij4MfgLX7a0icoHAsoEWyjZ7ItffUOU59xa6cWZ6gdgYVMjRiUFRubHptHyxIgecg8St4SNvS5kC7qYsn393jq5q5E1H77MWXpCSd0z9wIk4Lfyy6q-pK24EHs3wl7DxTjSJXXLbzYRqIODitzW1SA1PdjY9_8jkXuN9qrMClwo-2MoM21vcuLI8vnhAKaQM4ie8XZ3WvbFTjifiAoocGAKEQewuyxoh4BjYvxUcORHKOI0vu4b8SY6R0A32Q-YBZSOt6wJ3xNB3a0e0ltVjeyJ75R2UolRcOCno4i0iTV2rlpTKYl7qtKP5BF-F0Lr19jDfElN9mJFHodSGoyxN8Fve5qI3feLx1Jx4g&src-supplier=Compliance+Statements; ComponentLink10URL: https://octopart.com:443/opatz8j6/c1?t=RiDmXYTcocB5VTVcecSsgwh_WiftpTNbHD3NI75TB2vhgswH7GI1mebO56rJ_bxGOVwJZMSStUy2QO6eH4jsz0KF5BLnwlGvhCzJJ3IuEgFGr9O7FsgdZtoT9Jy3dQuGguWVmdfcuYyfXxnByPYst-lQd3qU64dvWGiFdD18IIO74j-JKN-_3UqJ0RHKmyq2QxmQ-tlL1pYp1KyTU9ZtoGkZCCvoacgR_vCx95iUH5OKtg2oA1oTPdzPVWV49_-FQChVU9ccpbyhmuGp13v2wfWzX9NuZzcgjXXQfQWKN0fG4_GqZdNmJRJa9iRpsYstIIOZcELJcEZQCBZinHqWbgdxUJugHo1-U4qdqy5F6gl1spw&src-supplier=Compliance+Statements; ComponentLink10Description: https://octopart.com:443/opatz8j6/c1?t=RiDmXYTcocB5VTVcecSsgwh_WiftpTNbHD3NI75TB2vhgswH7GI1mebO56rJ_bxGOVwJZMSStUy2QO6eH4jsz0KF5BLnwlGvhCzJJ3IuEgFGr9O7FsgdZtoT9Jy3dQuGguWVmdfcuYyfXxnByPYst-lQd3qU64dvWGiFdD18IIO74j-JKN-_3UqJ0RHKmyq2QxmQ-tlL1pYp1KyTU9ZtoGkZCCvoacgR_vCx95iUH5OKtg2oA1oTPdzPVWV49_-FQChVU9ccpbyhmuGp13v2wfWzX9NuZzcgjXXQfQWKN0fG4_GqZdNmJRJa9iRpsYstIIOZcELJcEZQCBZinHqWbgdxUJugHo1-U4qdqy5F6gl1spw&src-supplier=Compliance+Statements
U10 = CMP-0388-00548-1: Postive and Negative Output DC-DC Converter, 2.7 to 5.5 V, -40 to 85 degC, 24-pin QFN (RGE24), Green (RoHS & no Sb/Br); Manufacturer: Texas Instruments; SubFamily: LCD/OLED Display Bias Solutions; Rating: Catalog; Vin(Max)(V): 5.5; Topology: Boost, Inverting Buck/Boost; Vin(Min)(V): 2.7; Switching Frequency(Typ)(kHz): 1400; Iq(Typ)(mA): 0.5; PackageVersion: 4204104/G; PartNumber: TPS65130RGER; ComponentLink1URL: http://www.ti.com/; ComponentLink2Description: Datasheet; ComponentLink1Description: Manufacturer URL; DatasheetVersion: SLVS493B; Eco-Plan: Green (RoHS & no Sb/Br); PackageReference: RGE24-2450X2450TP; ComponentLink2URL: http://www.ti.com/general/docs/lit/getliterature.tsp?genericPartNumber=TPS65130&fileType=pdf; Code_JEDEC: MO-220; ComponentLink3URL: http://www.ti.com/litv/pdf/mpqf124f; PackageDescription: 24-Pin Plastic Flat Pack, Body 4 x 4 mm, 0.5 mm Pitch; ComponentLink3Description: Package Specification; Mounting Technology: Surface Mount
U11 = ADP7182AUJZ-5.0-R7: IC REG LIN -5V 200MA TSOT-23-5; Manufacturer: Analog Devices; Manufacturer Lifecycle Status: PRODUCTION; Accuracy: 1%; Dropout Voltage: -25mV; Max Supply Voltage: -28V; Max Junction Temperature (Tj): 125°C; Max Output current: -200mA; Max Output Voltage: -25.3V; Max Supply Current: -650µA; Min Current Limit: 230mA; Min Input Voltage: -2.7V; Number of Outputs: 1; Output Type: Fixed; Polarity: Negative; Power Supply Rejection Ratio (PSRR): 45dB; Quiescent Current: 53µA; Supplier: Newark; Supplier Part Number: 60AK5481; Manufacturer Part Number: ADP7182AUJZ-5.0-R7; RoHS: Compliant; Category: Voltage Regulators - Linear; Stock: 2315; Pricing: 1=4.78, 10=4.38, 25=4.05, 50=4.05, 100=3.76, 250=3.51, 500=3.34, 1000=3.28 (CAD); Ambient Temperature Range High: 85°C; Case/Package: SOT-23-5; Contact Plating: Tin; Height: 1mm; Lead Free: Contains Lead; Lifecycle Status: Production; Max Operating Temperature: 125°C; Min Operating Temperature: -40°C; Min Output Voltage: -2.7V; Min Supply Voltage: -2.7V; Mounting Technology: Surface Mount; Nominal Supply Current: -650µA; Pins: 5; Number of Regulators: 1; Operating Supply Current: -650µA; Output Current: 200mA; Output Voltage: -5V; Schedule B: 8542390000, 8542390000|8542390000|8542390000|8542390000|8542390000; ComponentLink1URL: https://octopart.com:443/opatz8j6/c1?t=f-sdDTfXUVUM9OgjWryEfiH86oBvaVRuJmONzRbNFEqgpZPystiR-9nyp_nqx6AZJ500OHuifHWGTrSP0lSTnLCVYkbKMz3F73dtQu4l8E5wQ_y8reylnxaFQwtUR60IstaFe3eI3k-hdng0q8E_F_ovWGYaM2MZ6QDaP20Aw613KOXUpMzFtF_tWJ-bBmOHO7a9_gRE_U1ZWk_oZSNkzTJaNC45ojDeTElJ3N_68Jwc9bOMWPotK9LFj15An9Nt1JT2s6V5_FRC6svwXmQ3MhG76Fp6UdiS7525-JwBydvItwRtqI7mlA&src-supplier=Analog+Devices; ComponentLink1Description: https://octopart.com:443/opatz8j6/c1?t=f-sdDTfXUVUM9OgjWryEfiH86oBvaVRuJmONzRbNFEqgpZPystiR-9nyp_nqx6AZJ500OHuifHWGTrSP0lSTnLCVYkbKMz3F73dtQu4l8E5wQ_y8reylnxaFQwtUR60IstaFe3eI3k-hdng0q8E_F_ovWGYaM2MZ6QDaP20Aw613KOXUpMzFtF_tWJ-bBmOHO7a9_gRE_U1ZWk_oZSNkzTJaNC45ojDeTElJ3N_68Jwc9bOMWPotK9LFj15An9Nt1JT2s6V5_FRC6svwXmQ3MhG76Fp6UdiS7525-JwBydvItwRtqI7mlA&src-supplier=Analog+Devices; ComponentLink2URL: https://datasheet.octopart.com:443/ADP7182AUJZ-5.0-R7-Analog-Devices-datasheet-32539719.pdf?src-supplier=Analog+Devices; ComponentLink2Description: https://datasheet.octopart.com:443/ADP7182AUJZ-5.0-R7-Analog-Devices-datasheet-32539719.pdf?src-supplier=Analog+Devices; ComponentLink3URL: https://datasheet.octopart.com:443/ADP7182AUJZ-5.0-R7-Analog-Devices-datasheet-22148519.pdf?src-supplier=Analog+Devices; ComponentLink3Description: https://datasheet.octopart.com:443/ADP7182AUJZ-5.0-R7-Analog-Devices-datasheet-22148519.pdf?src-supplier=Analog+Devices; ComponentLink4URL: https://datasheet.octopart.com:443/ADP7182AUJZ-5.0-R7-Analog-Devices-datasheet-15407874.pdf?src-supplier=Analog+Devices; ComponentLink4Description: https://datasheet.octopart.com:443/ADP7182AUJZ-5.0-R7-Analog-Devices-datasheet-15407874.pdf?src-supplier=Analog+Devices; ComponentLink5URL: https://datasheet.octopart.com:443/ADP7182AUJZ-5.0-R7-Analog-Devices-datasheet-138896290.pdf?src-supplier=element14+APAC; ComponentLink5Description: https://datasheet.octopart.com:443/ADP7182AUJZ-5.0-R7-Analog-Devices-datasheet-138896290.pdf?src-supplier=element14+APAC; ComponentLink6URL: https://sigma.octopart.com:443/140664465/technical_drawing/Analog-Devices-ADP7182AUJZ-5.0-R7.pdf?src-supplier=Upverter; ComponentLink6Description: https://sigma.octopart.com:443/140664465/technical_drawing/Analog-Devices-ADP7182AUJZ-5.0-R7.pdf?src-supplier=Upverter; ComponentLink7URL: https://datasheet.octopart.com:443/ADP7182AUJZ-5.0-R7-Analog-Devices-datasheet-81715052.pdf?src-supplier=Augswan; ComponentLink7Description: https://datasheet.octopart.com:443/ADP7182AUJZ-5.0-R7-Analog-Devices-datasheet-81715052.pdf?src-supplier=Augswan; ComponentLink8URL: https://datasheet.octopart.com:443/ADP7182AUJZ-5.0-R7-Analog-Devices-datasheet-80865417.pdf?src-supplier=Farnell; ComponentLink8Description: https://datasheet.octopart.com:443/ADP7182AUJZ-5.0-R7-Analog-Devices-datasheet-80865417.pdf?src-supplier=Farnell; ComponentLink9URL: https://datasheet.octopart.com:443/ADP7182AUJZ-5.0-R7-Analog-Devices-datasheet-140566826.pdf?src-supplier=Arrow.cn; ComponentLink9Description: https://datasheet.octopart.com:443/ADP7182AUJZ-5.0-R7-Analog-Devices-datasheet-140566826.pdf?src-supplier=Arrow.cn; ComponentLink10URL: http://sigma.octopart.com:80/conflict_mineral_statement/Analog-Devices-company-33.pdf?src-supplier=Compliance+Statements; ComponentLink10Description: http://sigma.octopart.com:80/conflict_mineral_statement/Analog-Devices-company-33.pdf?src-supplier=Compliance+Statements; ComponentLink11URL: https://octopart.com:443/opatz8j6/c1?t=TC2AIcbmrW42p4cgxYDuYVgbub91Pn7JPAgX-RC7ws71fwQaC7UR5ET4F9cMUxgzDTZDFagmnhTPsBD4G5cR3IGQsdmoF0g22yNF17U652quAJlUW_MaX5mK0a-q5wmr6xMfqBnhng-3upd6Om9hyjFK8mDbfDC1T-5p5-ZdMqrxMSEd1hpzCQ0IKq6PxALpuIgp5OdNrKz_GwdkIhLzo5c3fXuUugOx6Xbp1zu61IAv6Exf2JBHmv6XumEoMC1ee1mtpP_6Z-nVSNeE3XeDQrz-nQpA-sIhIMSMlW2ckA-yS7oBcBQ1bw&src-supplier=Compliance+Statements; ComponentLink11Description: https://octopart.com:443/opatz8j6/c1?t=TC2AIcbmrW42p4cgxYDuYVgbub91Pn7JPAgX-RC7ws71fwQaC7UR5ET4F9cMUxgzDTZDFagmnhTPsBD4G5cR3IGQsdmoF0g22yNF17U652quAJlUW_MaX5mK0a-q5wmr6xMfqBnhng-3upd6Om9hyjFK8mDbfDC1T-5p5-ZdMqrxMSEd1hpzCQ0IKq6PxALpuIgp5OdNrKz_GwdkIhLzo5c3fXuUugOx6Xbp1zu61IAv6Exf2JBHmv6XumEoMC1ee1mtpP_6Z-nVSNeE3XeDQrz-nQpA-sIhIMSMlW2ckA-yS7oBcBQ1bw&src-supplier=Compliance+Statements